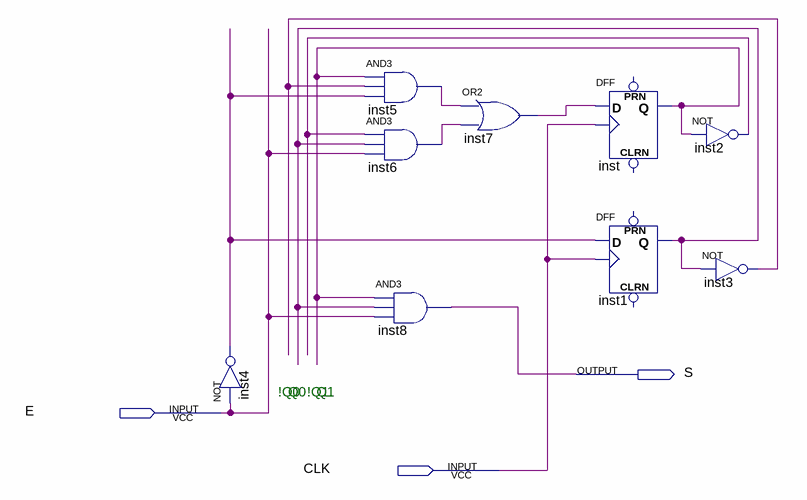
[diagram p0: schematic sheet]
// Quartus schematic ejercicio1.bdf as structural Verilog: 9 symbols, 3 pins
module ejercicio1 (
  input  E,
  input  CLK,
  output S
);

  wire inst1_q, inst2_out, inst3_out, inst4_out, inst5_out, inst6_out, inst7_out, inst_q;

  not inst4 (inst4_out, E);
  and inst5 (inst5_out, inst_q, inst3_out, inst4_out);
  and inst6 (inst6_out, inst2_out, inst1_q, E);
  and inst8 (S, inst_q, inst1_q, E);
  or inst7 (inst7_out, inst5_out, inst6_out);
  DFF inst (.CLK(CLK), .D(inst7_out), .Q(inst_q));  // open: CLRN, PRN
  DFF inst1 (.CLK(CLK), .D(inst4_out), .Q(inst1_q));  // open: CLRN, PRN
  not inst2 (inst2_out, inst_q);
  not inst3 (inst3_out, inst1_q);

  // Notes on the sheet:
  //   !Q0
  //   Q0
  //   !Q1
  //   Q1
endmodule
